# EAGLE design 2020can_master_v2 (EAGLE 9.5.2)
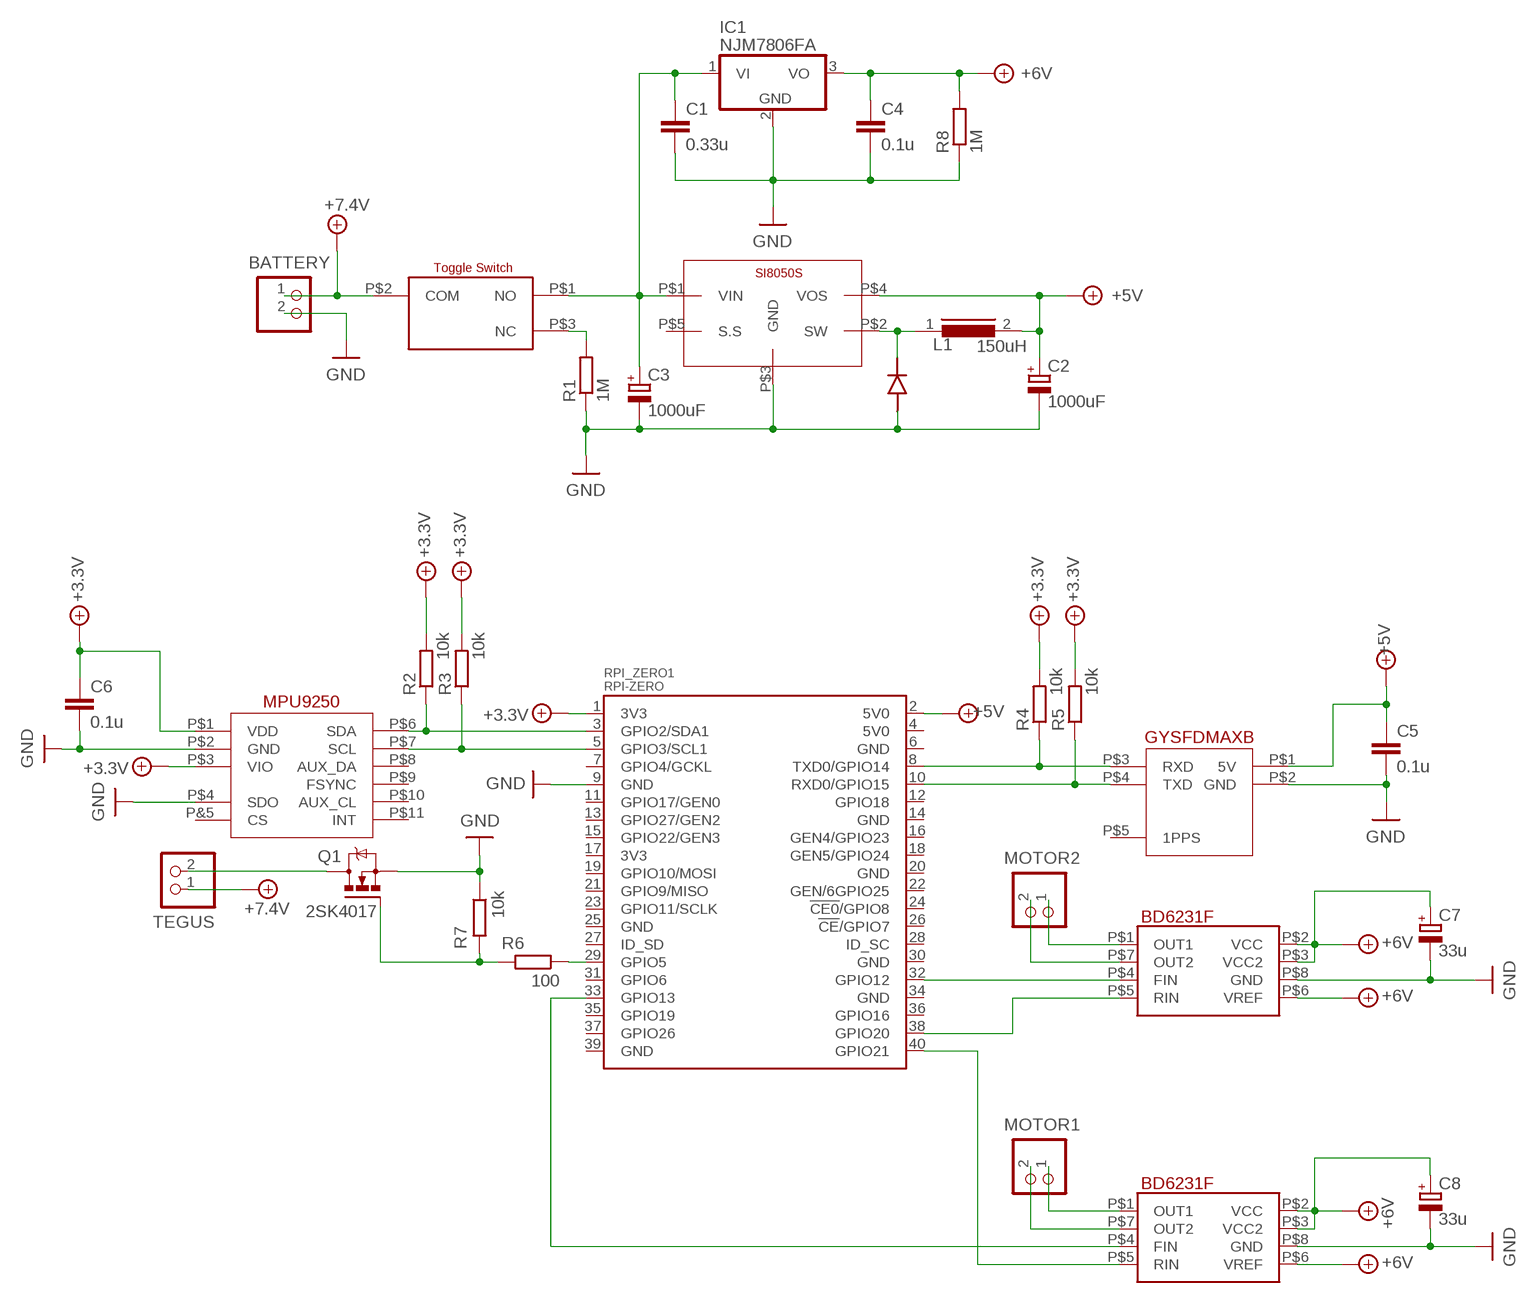
[diagram p0: schematic, sheet 1]

## Parts
BATTERY  B2P-VH  [B2P-VH]
BD6231F1  BD6231F  [BD62**_SOP8]
BD6231F2  BD6231F  [BD62**_SOP8]
C1  0.33u  C5/3  [C5B3]
C2  1000uF  CPOL-EUE5-10.5  [E5-10,5]
C3  1000uF  CPOL-EUE5-10.5  [E5-10,5]
C4  0.1u  C5/3  [C5B3]
C5  0.1u  C5/3  [C5B3]
C6  0.1u  C5/3  [C5B3]
C7  33u  CPOL-EUE2,5-6E  [E2,5-6E]
C8  33u  CPOL-EUE2,5-6E  [E2,5-6E]
DIODE_1.1  DIODE_1.5  [DIODE_1.5]
GYSFDMAXB1  GYSFDMAXB  [GYSFDMAXB]
IC1  NJM7806FA  786TV  [TO220V]
L1  150uH  SFT830D  [SFT830D]
MOTOR1  B2P-VH  [B2P-VH]
MOTOR2  B2P-VH  [B2P-VH]
MPU1  MPU9250  [MPU9250]
Q1  2SK4017  IRF530  [TO220BV]
R1  1M  R-EU_0207/10  [0207/10]
R2  10k  R-EU_0207/10  [0207/10]
R3  10k  R-EU_0207/10  [0207/10]
R4  10k  R-EU_0207/10  [0207/10]
R5  10k  R-EU_0207/10  [0207/10]
R6  100  R-EU_0207/10  [0207/10]
R7  10k  R-EU_0207/10  [0207/10]
R8  1M  R-EU_0207/10  [0207/10]
RPI_ZERO1  RPI-ZERO  [RASP_PI_ZERO_BOARD_FULL]
SI8050S1  SI8050S  [SI8050S]
SWITCH_2MS1T2B4M2QES1  SWITCH_2MS1T2B4M2QES  [SWITCH_2MS1T2B4M2QES]
TEGUS  B2P-VH  [B2P-VH]

## Nets
+4.1V [power]: MPU1.P$3(VIO) R2.2 R3.2 R4.2 R5.2 RPI_ZERO1.1(3V3) ; supply symbol labelled +3.3V
+5V [power]: C2.+ C5.1 GYSFDMAXB1.P$1(5V) L1.2 RPI_ZERO1.2(5V0) SI8050S1.P$4(VOS)
+7V [power]: BD6231F1.P$2(VCC) BD6231F1.P$3(VCC2) BD6231F1.P$6(VREF) BD6231F2.P$2(VCC) BD6231F2.P$3(VCC2) BD6231F2.P$6(VREF) C4.1 C7.+ C8.+ IC1.3(VO) R8.2 ; supply symbol labelled +6V
+8V [power]: BATTERY.1 SWITCH_2MS1T2B4M2QES1.P$2(COM) TEGUS.1 ; supply symbol labelled +7.4V
GND [power]: BATTERY.2 BD6231F1.P$8(GND) BD6231F2.P$8(GND) C1.2 C2.- C3.- C4.2 C5.2 C6.2 C7.- C8.- DIODE_1.1.P$1(ANODE) GYSFDMAXB1.P$2(GND) IC1.2(GND) MPU1.P$2(GND) MPU1.P$4(SDO) Q1.S R1.1 R7.1 R8.1 RPI_ZERO1.9(GND) SI8050S1.P$3(GND)
MOS_+ [power]: Q1.D TEGUS.2
N$1 [power]: R1.2 SWITCH_2MS1T2B4M2QES1.P$3(NC)
N$2 [power]: DIODE_1.1.P$2(CATHODE) L1.1 SI8050S1.P$2(SW)
N$3: MPU1.P$6(SDA) R2.1 RPI_ZERO1.3(GPIO2/SDA1)
N$4 [power]: C1.1 C3.+ IC1.1(VI) SI8050S1.P$1(VIN) SWITCH_2MS1T2B4M2QES1.P$1(NO)
N$5: BD6231F1.P$4(FIN) RPI_ZERO1.32(GPIO12)
N$6: MPU1.P$7(SCL) R3.1 RPI_ZERO1.5(GPIO3/SCL1)
N$7: GYSFDMAXB1.P$3(RXD) R4.1 RPI_ZERO1.8(TXD0/GPIO14)
N$8: GYSFDMAXB1.P$4(TXD) R5.1 RPI_ZERO1.10(RXD0/GPIO15)
N$9 [power]: BD6231F1.P$1(OUT1) MOTOR2.1
N$10: BD6231F2.P$4(FIN) RPI_ZERO1.33(GPIO13)
N$11 [power]: BD6231F1.P$7(OUT2) MOTOR2.2
N$12: BD6231F1.P$5(RIN) RPI_ZERO1.38(GPIO20)
N$13 [power]: BD6231F2.P$1(OUT1) MOTOR1.1
N$14 [power]: BD6231F2.P$7(OUT2) MOTOR1.2
N$15: BD6231F2.P$5(RIN) RPI_ZERO1.40(GPIO21)
N$16: Q1.G R6.2 R7.2
N$17: R6.1 RPI_ZERO1.29(GPIO5)
N$18 [power]: C6.1 MPU1.P$1(VDD) ; supply symbol labelled +3.3V
Unconnected: GYSFDMAXB1.P$5(1PPS) MPU1.P$8(AUX_DA) MPU1.P$9(FSYNC) MPU1.P$10(AUX_CL) MPU1.P$11(INT) MPU1.P&5(CS) RPI_ZERO1.4(5V0) RPI_ZERO1.6(GND) RPI_ZERO1.7(GPIO4/GCKL) RPI_ZERO1.11(GPIO17/GEN0) RPI_ZERO1.12(GPIO18) RPI_ZERO1.13(GPIO27/GEN2) RPI_ZERO1.14(GND) RPI_ZERO1.15(GPIO22/GEN3) RPI_ZERO1.16(GEN4/GPIO23) RPI_ZERO1.17(3V3) RPI_ZERO1.18(GEN5/GPIO24) RPI_ZERO1.19(GPIO10/MOSI) RPI_ZERO1.20(GND) RPI_ZERO1.21(GPIO9/MISO) RPI_ZERO1.22(GEN/6GPIO25) RPI_ZERO1.23(GPIO11/SCLK) RPI_ZERO1.24(!CE0!/GPIO8) RPI_ZERO1.25(GND) RPI_ZERO1.26(!CE!/GPIO7) RPI_ZERO1.27(ID_SD) RPI_ZERO1.28(ID_SC) RPI_ZERO1.30(GND) RPI_ZERO1.31(GPIO6) RPI_ZERO1.34(GND) RPI_ZERO1.35(GPIO19) RPI_ZERO1.36(GPIO16) RPI_ZERO1.37(GPIO26) RPI_ZERO1.39(GND) SI8050S1.P$5(S.S)

## Library data of the parts
BATTERY MOTOR1 MOTOR2 TEGUS = CONN_VH:B2P-VH: Wire-to-Board 3.96mm pitch top mount connector Source: http://www.jst-mfg.com/product/pdf/jpn/VH.pdf http://www.jst-mfg.com/product/detail.php?series=262
BD6231F1 BD6231F2 = BD62**:BD6231F: BD6231F; Full Bridge DC Motor Driver; 6V~32V; MAX 1A; http://akizukidenshi.com/catalog/g/gI-05088/
C1 C4-C6 = capacitor-wima:C: CAPACITOR naming: grid - package width
C2 C3 = resistor:CPOL-EU: POLARIZED CAPACITOR, European symbol
C7 C8 = rcl:CPOL-EU: POLARIZED CAPACITOR, European symbol; SPICEPREFIX: C
DIODE_1.1 = diode_1.5mm:DIODE_1.5
GYSFDMAXB1 = GYSFDMAXB:GYSFDMAXB: module with GPS "Michibiki"; http://akizukidenshi.com/catalog/g/gK-09991/
IC1 = linear:78*: Positive VOLTAGE REGULATOR Source: http://cache.national.com/ds/LM/LM78L05.pdf http://www.fairchildsemi.com/ds/LM/LM7805.pdf
L1 = inductors:SFT830D: INDUCTOR; SPICEPREFIX: L
MPU1 = MPU9250:MPU9250: a module of MPU9250 IMU sensor; https://learn.sparkfun.com/tutorials/mpu-9250-hookup-guide?_ga=1.139382715.926858641.1470020364
Q1 = transistor-power:IRF530: HEXFET Power MOSFET
R1-R8 = rcl:R-EU_: RESISTOR, European symbol; SPICEPREFIX: R
RPI_ZERO1 = RaspberryPi_Zero:RPI-ZERO: MICON
SI8050S1 = SI-8050S:SI8050S
SWITCH_2MS1T2B4M2QES1 = switch_2MS1T2B4M2QES:SWITCH_2MS1T2B4M2QES

## Net classes
0 default: width 0.3 mm, clearance 0.1 mm
1 power: width 1 mm, clearance 0.3 mm
2 mos: width 1.2 mm, clearance 0.5 mm

## Board
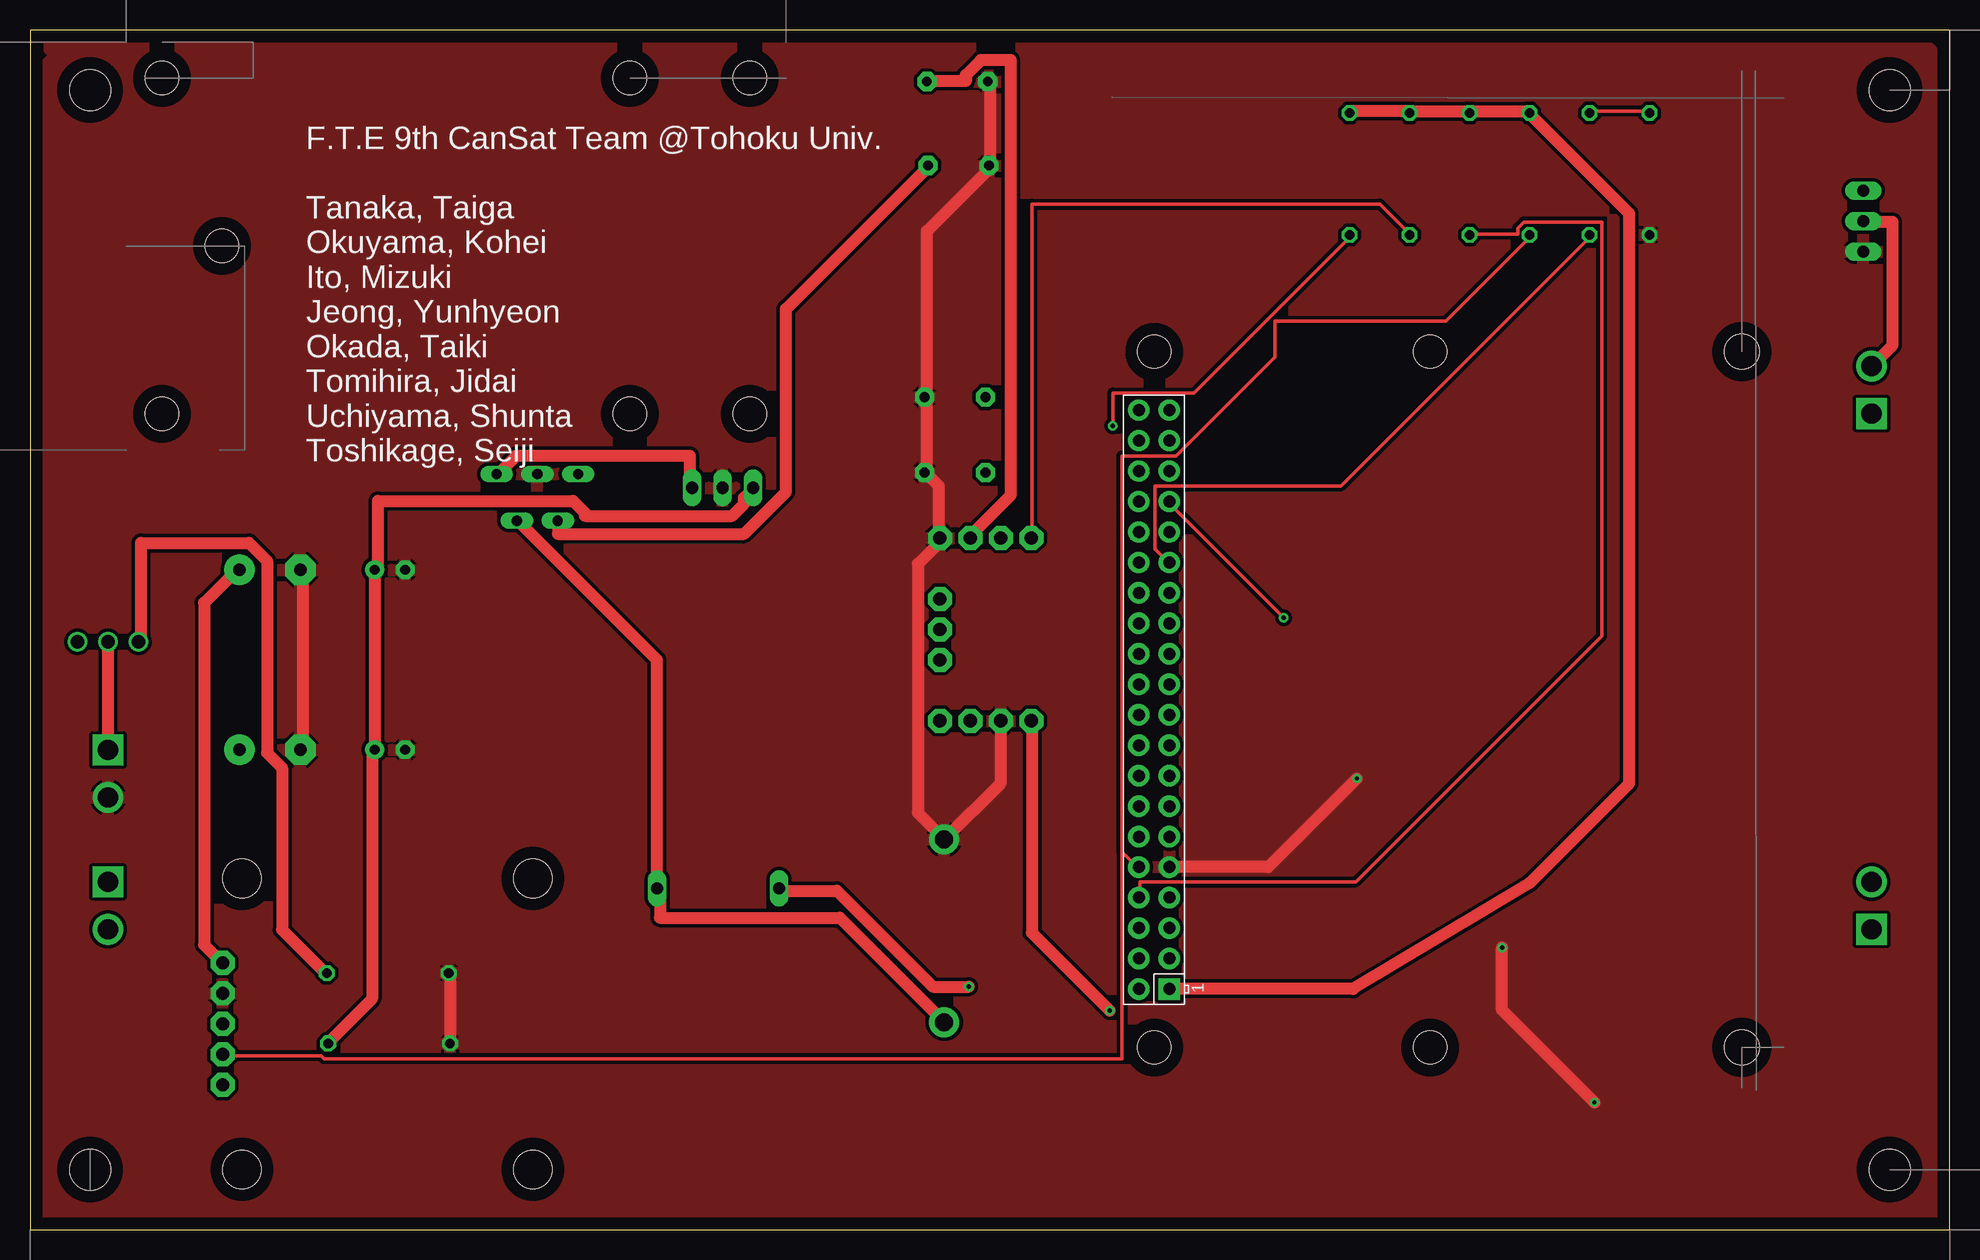
[diagram p1: board, top side]
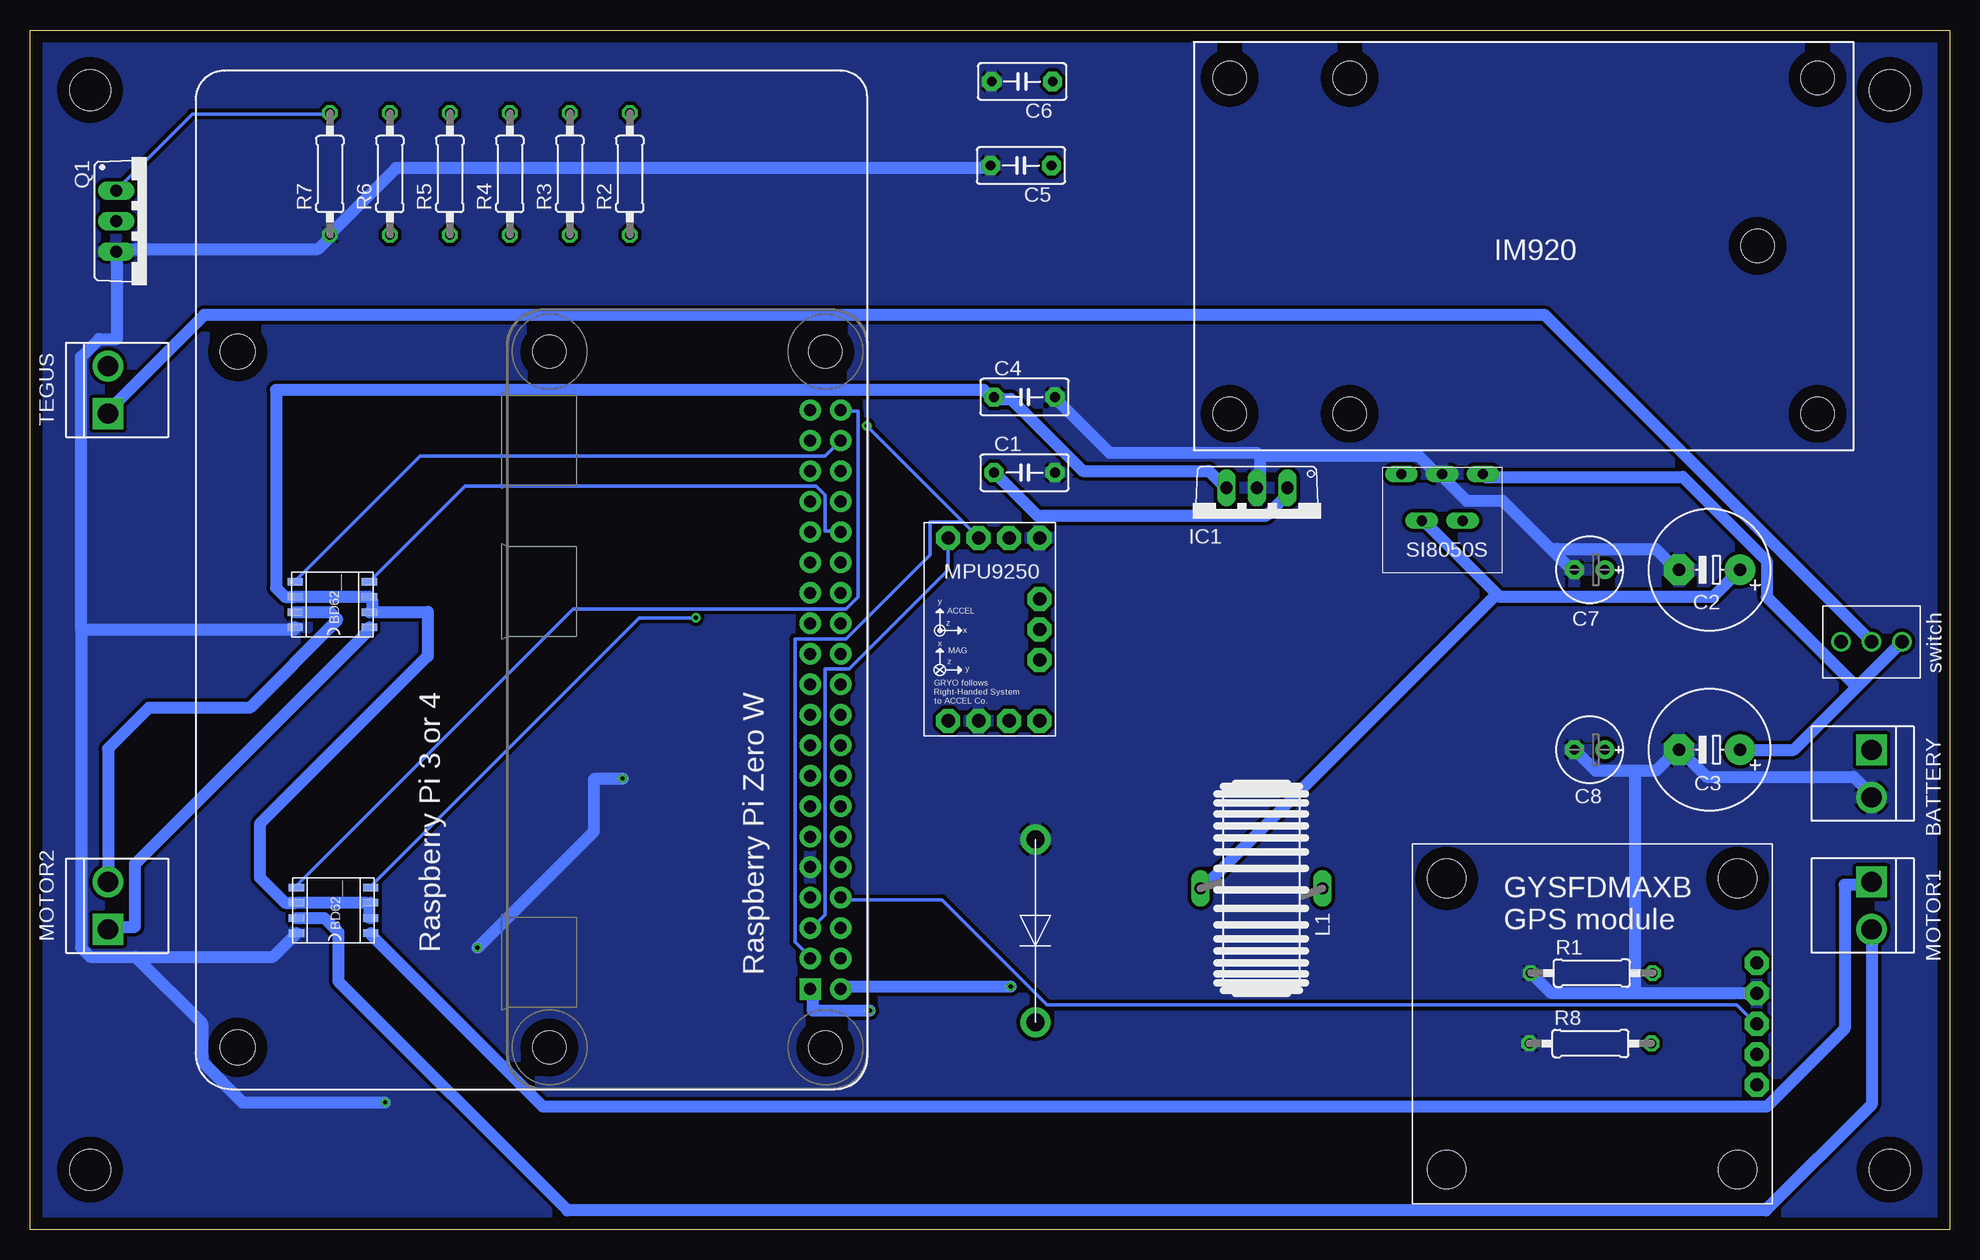
[diagram p2: board, bottom side, seen from below]

Size 160 x 100 mm. Coordinates in mm from the lower left corner, seen from the top.
Outline: 0,0 160,0 160,100 0,100 0,0
Copper layers (1*16): Top 0.035mm / dielectric 1.5mm / Bottom 0.035mm
Design rules "default": minimum track width 6mil, minimum drill 0.35mm, track to track 6mil, track to pad 6mil, pad to pad 6mil, via to via 6mil, smd to smd 6mil, copper to edge 40mil, drill to drill 6mil, minimum pad ring 10mil, minimum via ring 8mil, stop-mask expansion 4mil, vias tented up to drill 0mil, thermal gap 10mil
Holes 3.4 mm at 5,95 155,95 155,5 5,5
Holes 2.9 mm at 142.7,15.2 142.7,73.2
Holes 2.8 mm at 11,68 60,68 60,96 11,96 16,82 50,96 50,68

### Footprints (pad centres in the part's own frame; a part is rotated, then mirrored left to right if it is on the bottom)
B2P-VH = drill 1.7 square: 1 -1.98,0 | drill 1.7: 2 1.98,0
BD62**_SOP8 = smd 0.635 x 1.27: P$1 0.595,0; P$2 1.865,0; P$3 3.135,0; P$4 4.405,0; P$5 4.405,6.2; P$6 3.135,6.2; P$7 1.865,6.2; P$8 0.595,6.2
C5B3 = drill 0.813 pad 1.6 octagon: 1 -2.54,0; 2 2.54,0
E5-10,5 = drill 1.016 pad 2.54: + -2.54,0 | drill 1.016 pad 2.54 octagon: - 2.54,0
E2,5-6E = drill 0.813 pad 1.575: + -1.27,0 | drill 0.813 pad 1.575 octagon: - 1.27,0
DIODE_1.5 = drill 1.5 pad 2.5: P$1 -7.62,0; P$2 7.62,0
GYSFDMAXB = drill 1.1 pad 2 octagon: P$1 28.73,20.08; P$2 28.73,17.54; P$3 28.73,15; P$4 28.73,12.46; P$5 28.73,9.92 | hole 3.2: 2.87,27.13; 27.13,27.13; 2.87,2.87; 27.13,2.87
TO220V = drill 1.016 long: 1 -2.54,-2.54; 2 0,-2.54; 3 2.54,-2.54
SFT830D = drill 1.016 long: 1 -5.08,0; 2 5.08,0
MPU9250 = drill 1.1 pad 2 octagon: P$1 7.08,16.51; P$2 9.62,16.51; P$3 2,1.27; P$4 4.54,1.27; P$6 4.54,16.51; P$7 2,16.51; P$8 9.62,11.43; P$9 9.62,8.89; P$10 9.62,6.35; P$11 9.62,1.27; P&5 7.08,1.27
TO220BV = drill 1.016 long: D 0,-2.54; G -2.54,-2.54; S 2.54,-2.54
0207/10 = drill 0.813 octagon: 1 -5.08,0; 2 5.08,0
RASP_PI_ZERO_BOARD_FULL = drill 1 pad 1.778 square: 1 8.37,25.23 | drill 1 pad 1.778: 2 8.37,27.77; 3 10.91,25.23; 4 10.91,27.77; 5 13.45,25.23; 6 13.45,27.77; 7 15.99,25.23; 8 15.99,27.77; 9 18.53,25.23; 10 18.53,27.77; 11 21.07,25.23; 12 21.07,27.77; 13 23.61,25.23; 14 23.61,27.77; 15 26.15,25.23; 16 26.15,27.77; 17 28.69,25.23; 18 28.69,27.77; 19 31.23,25.23; 20 31.23,27.77; 21 33.77,25.23; 22 33.77,27.77; 23 36.31,25.23; 24 36.31,27.77; 25 38.85,25.23; 26 38.85,27.77; 27 41.39,25.23; 28 41.39,27.77; 29 43.93,25.23; 30 43.93,27.77; 31 46.47,25.23; 32 46.47,27.77; 33 49.01,25.23; 34 49.01,27.77; 35 51.55,25.23; 36 51.55,27.77; 37 54.09,25.23; 38 54.09,27.77; 39 56.63,25.23; 40 56.63,27.77 | hole 2.75: 3.5,3.5; 3.5,26.5; 61.5,3.5; 61.5,26.5
SI8050S = drill 0.85 pad 0.9 long: P$1 -3.4,-8.2; P$2 -1.7,-4.3; P$3 0,-8.2; P$4 1.7,-4.3; P$5 3.4,-8.2
SWITCH_2MS1T2B4M2QES = drill 1.09: P$1 0,2.54; P$2 0,0; P$3 0,-2.54

### Placement (x,y rotation side)
BATTERY  6.5,38 270 bottom
BD6231F1  131.7,49.6 90 bottom
BD6231F2  131.6,24.1 90 bottom
C1  77.1,63.1 0 bottom
C2  20,55 180 bottom
C3  20,40 180 bottom
C4  77.1,69.4 0 bottom
C5  77.4,88.7 180 bottom
C6  77.3,95.7 180 bottom
C7  30,55 180 bottom
C8  30,40 180 bottom
DIODE_1.1  76.2,24.9 270 bottom
GYSFDMAXB1  44.79,2.14 0 bottom
IC1  57.72,59.29 180 bottom
L1  57.36,28.44 180 bottom
MOTOR1  6.5,27 270 bottom
MOTOR2  153.5,27 90 bottom
MPU1  85.46,41.14 0 bottom
Q1  150.27,84.07 270 bottom
R1  29.82,21.38 0 bottom
R2  110,88 90 bottom
R3  115,88 90 bottom
R4  120,88 90 bottom
R5  125,88 90 bottom
R6  130,88 90 bottom
R7  135,88 90 bottom
R8  29.93,15.51 0 bottom
RPI_ZERO1  120.2,11.68 90 top
SI8050S1  42.29,54.79 180 bottom
SWITCH_2MS1T2B4M2QES1  6.5,49 270 bottom
TEGUS  153.5,70 90 bottom

### Tracks (layer width: path | path; a pad name or v marks a point on that pad's centre or on a via)
+4.1V  (via drill 0.35)
  Top 1: R2.2 110,93.25 115,93.25 R3.2 115.25,93.25 120,93.25 R4.2 120.25,93.25 125,93.25 R5.2 125.25,92.75 133.3,84.7 133.3,37.2 124.96,28.86 110.28,20.05 RPI_ZERO1.1 | v90,18.25 83.5,24.75 83.5,42.25 MPU1.P$3
  Bottom 1: v90,18.25 94.75,18.25 94.75,20 RPI_ZERO1.1
+5V  (via drill 0.35)
  Top 1: C5.1 74.75,88.5 63,76.75 63,61.5 59.5,58 44,58 44,59 SI8050S1.P$4 | v78.25,20.25 75.25,20.25 67.25,28.25 62.5,28.25 L1.2 | GYSFDMAXB1.P$1 16,22.25 14.5,23.75 14.5,52.25 17.25,55 C2.+
  Bottom 1: 37.75,53 37.5,52.75 19.75,52.75 17.5,55 C2.+ | 37.75,53 43.75,59 SI8050S1.P$4 | 37.75,53 62.25,28.5 L1.2 | v78.25,20.25 92.25,20.25 RPI_ZERO1.2
+7V
  Top 1: R8.2 25,15.75 28.5,19.25 28.5,40 C8.+ 28.75,40.25 28.75,55 C7.+ 29,55.25 29,60.75 45.25,60.75 46.25,59.75 46.25,59.5 58.5,59.5 59.5,60.5 59.5,61 60.25,61.75 IC1.3
  Bottom 1: BD6231F2.P$2 131.75,26 131.75,27 BD6231F2.P$3 132,27.25 137.75,27.25 BD6231F2.P$6 138.25,27.25 138.75,27.25 140.85,29.35 140.85,33.8 126.85,47.8 126.85,51.5 131.5,51.5 | 131.5,51.5 131.5,52.5 BD6231F1.P$3 132,52.75 137.75,52.75 BD6231F1.P$6 138.25,52.75 138.75,52.75 139.5,53.5 139.5,70 80.5,70 80,69.5 C4.1 79.5,69.25 78.25,69.25 72.25,63.25 61.75,63.25 60.5,62 IC1.3 | 131.5,51.5 BD6231F1.P$2
+8V
  Top 1: BATTERY.1 SWITCH_2MS1T2B4M2QES1.P$2
  Bottom 1: SWITCH_2MS1T2B4M2QES1.P$2 33.75,76.25 145.5,76.25 153.5,68.25 TEGUS.1
GND  (via drill 0.35)
  Top 1: C6.2 80,95.5 80,88.75 C5.2 79.75,88.25 74.75,83.25 74.75,69.75 C4.2 74.75,69.25 74.75,63.5 C1.2 74.75,63 75.75,62 75.75,57.75 MPU1.P$2 75.75,57.25 74,55.5 74,34.75 76,32.75 DIODE_1.1.P$1 80.92,37.24 MPU1.P$4 | R8.1 35,15.75 35,21.25 R1.1 | C2.- 22.75,55 22.75,40 C3.- | v130.4,10.6 122.7,18.3 v122.7,23.5 | v110.6,37.6 103.21,30.21 RPI_ZERO1.9
  Bottom 1: 151.2,22.75 155,22.75 155.75,23.5 155.75,50 | 151.2,22.75 139.75,22.75 138,24.5 BD6231F2.P$8 | 155.75,50 138,50 BD6231F1.P$8 | 155.75,50 155.75,72.75 154.25,74.25 152.75,74.25 152.75,81 Q1.S 152.75,81.75 136,81.75 135,82.75 R7.1 134.75,83.25 129.5,88.5 80,88.5 C5.2 | 33,56.5 31.5,55 C7.- | 33,56.5 37.25,60.75 40.25,60.75 42.25,62.75 SI8050S1.P$3 42.75,63 44.25,64.5 57.5,64.5 | 57.5,64.5 57.5,62 IC1.2 | C2.- 22.75,55 24.5,56.75 32.75,56.75 33,56.5 | 26.25,19.75 33.25,19.75 34.75,21.25 R1.1 | 26.25,19.75 16.25,19.75 GYSFDMAXB1.P$2 | 26.25,38.25 24.5,38.25 22.75,40 C3.- 22.25,39.75 20.25,37.75 8,37.75 6.5,36.25 BATTERY.2 | 26.25,38.25 29.5,38.25 31.25,40 C8.- | 26.25,38.25 26.25,19.75 | C4.2 74.5,69.25 70,64.75 57.75,64.75 57.5,64.5 | 151.2,22.75 145.67,17.22 145.67,13.97 142.29,10.6 v130.4,10.6 | v122.7,23.5 113,33.2 113,37.5 112.9,37.6 v110.6,37.6
  other vias: 94.97,30.21
  pour Bottom: 0.7,99 158.5,99 158.9,98.6 158.9,1.3 159.2,1 1.4,1 1.4,98.3 1.7,98.6
  pour Top: 1.4,98.6 158.2,98.6 158.5,98.3 158.5,1 159.2,0.3 1.8,0.3 1.4,0.7 1.4,97.2 2.1,97.9
MOS_+
  Top 1: Q1.D 153,84 155.25,84 155.25,73.75 153.5,72 TEGUS.2
N$1
  Top 1: R1.2 24.5,21.5 21,25 21,38.5 19.75,39.75 19.75,55.75 18.25,57.25 9.25,57.25 9.25,49 SWITCH_2MS1T2B4M2QES1.P$3
N$2
  Top 1: SI8050S1.P$2 40.75,59 52.25,47.5 52.25,28.5 L1.1 52.5,28 52.5,26 67.5,26 76,17.5 DIODE_1.1.P$2
N$3  (via drill 0.35)
  Top 0.3: v90.25,67 90.25,69.75 97,69.75 110,82.75 R2.1
  Bottom 0.3: 82.25,59 81,57.75 MPU1.P$6 | 82.25,59 v90.25,67 | 82.25,59 85,59 85,56.25 92,49.25 96.25,49.25 96.25,24 95,22.75 RPI_ZERO1.3
N$4
  Top 1: SI8050S1.P$1 39,63 40.5,64.5 55,64.5 55,62 IC1.1
  Bottom 1: 7.75,45.25 13,40 C3.+ | 7.75,45.25 4,49 SWITCH_2MS1T2B4M2QES1.P$1 | C1.1 79.5,63 76,59.5 57,59.5 55.25,61.25 55.25,61.75 IC1.1 | 7.75,45.25 15.25,52.75 15.25,55.75 22.25,62.75 38.75,62.75 SI8050S1.P$1
N$5
  Bottom 0.3: BD6231F1.P$4 131.5,54.25 123.75,62 94.5,62 93.75,61.25 93.75,58.25 92.5,58.25 RPI_ZERO1.32
N$6
  Top 0.3: R3.1 115,83 112.5,85.5 83.5,85.5 83.5,57.75 MPU1.P$7
  Bottom 0.3: RPI_ZERO1.5 94.75,25.25 93.75,26.25 93.75,46.75 91.75,46.75 83.5,55 83.5,57.5 MPU1.P$7
N$7
  Top 0.3: R4.1 120,83 124,83 124,83.5 124.5,84 131,84 131,49.5 110.5,29 92.5,29 92.5,27.75 RPI_ZERO1.8
  Bottom 0.3: GYSFDMAXB1.P$3 16.25,17.25 17.75,18.75 75.25,18.75 84,27.5 92.25,27.5 RPI_ZERO1.8
N$8
  Top 0.3: 91,31.5 91,64.5 95.5,64.5 103.75,72.75 103.75,75.75 118,75.75 125,82.75 R5.1 | 91,31.5 92.25,30.25 RPI_ZERO1.10 | 91,31.5 91,14.25 24.5,14.25 24.25,14.5 16.25,14.5 GYSFDMAXB1.P$4
N$9
  Bottom 1: BD6231F1.P$1 131.75,50 151.25,30.5 151.25,25.25 153.5,25.25 MOTOR2.1
N$10  (via drill 0.35)
  Top 0.3: v104.5,51 95,60.5 RPI_ZERO1.33
  Bottom 0.3: v104.5,51 109.25,51 131.5,28.75 BD6231F2.P$4
N$11
  Bottom 1: BD6231F1.P$7 134.97,51.47 134.4,50.9 134.4,50.8 141.7,43.5 150.1,43.5 153.5,40.1 MOTOR2.2
N$12
  Bottom 0.3: BD6231F1.P$5 137.75,54.25 127.5,64.5 93.75,64.5 92.5,65.75 RPI_ZERO1.38
N$13
  Bottom 1: BD6231F2.P$1 131.5,24.5 117.25,10.25 15.25,10.25 8.75,16.75 8.75,28.75 6.5,28.75 MOTOR1.1
N$14
  Bottom 1: MOTOR1.2 6.5,10.4 15.3,1.6 115.2,1.6 134.3,20.7 134.3,24.8 135.47,25.96 BD6231F2.P$7
N$15
  Bottom 0.3: BD6231F2.P$5 137.75,28.75 114.75,51.75 92,51.75 91,52.75 91,68.25 92.25,68.25 RPI_ZERO1.40
N$16
  Top 0.3: R6.2 130,93.25 135,93.25 R7.2
  Bottom 0.3: Q1.G 152.75,86.75 146.5,93 135,93 R7.2
N$17
  Top 0.3: R6.1 130,82.75 109.25,62 93.75,62 93.75,56.75 94.75,55.75 RPI_ZERO1.29
N$18
  Top 1: C6.1 75,95.75 78,95.75 78,96.25 79.25,97.5 81.75,97.5 81.75,61.25 78.5,58 78.5,57.75 MPU1.P$1

### Text on the board
tPlace: F.T.E 9th CanSat Team @Tohoku Univ. / / Tanaka, Taiga / Okuyama, Kohei / Ito, Mizuki / Jeong, Yunhyeon / Okada, Taiki / Tomihira, Jidai / Uchiyama, Shunta / Toshikage, Seiji
bPlace: IM920 | Raspberry Pi Zero W | Raspberry Pi 3 or 4